# EAGLE design Thermal Gradient Experiment Board (EAGLE 6.3)
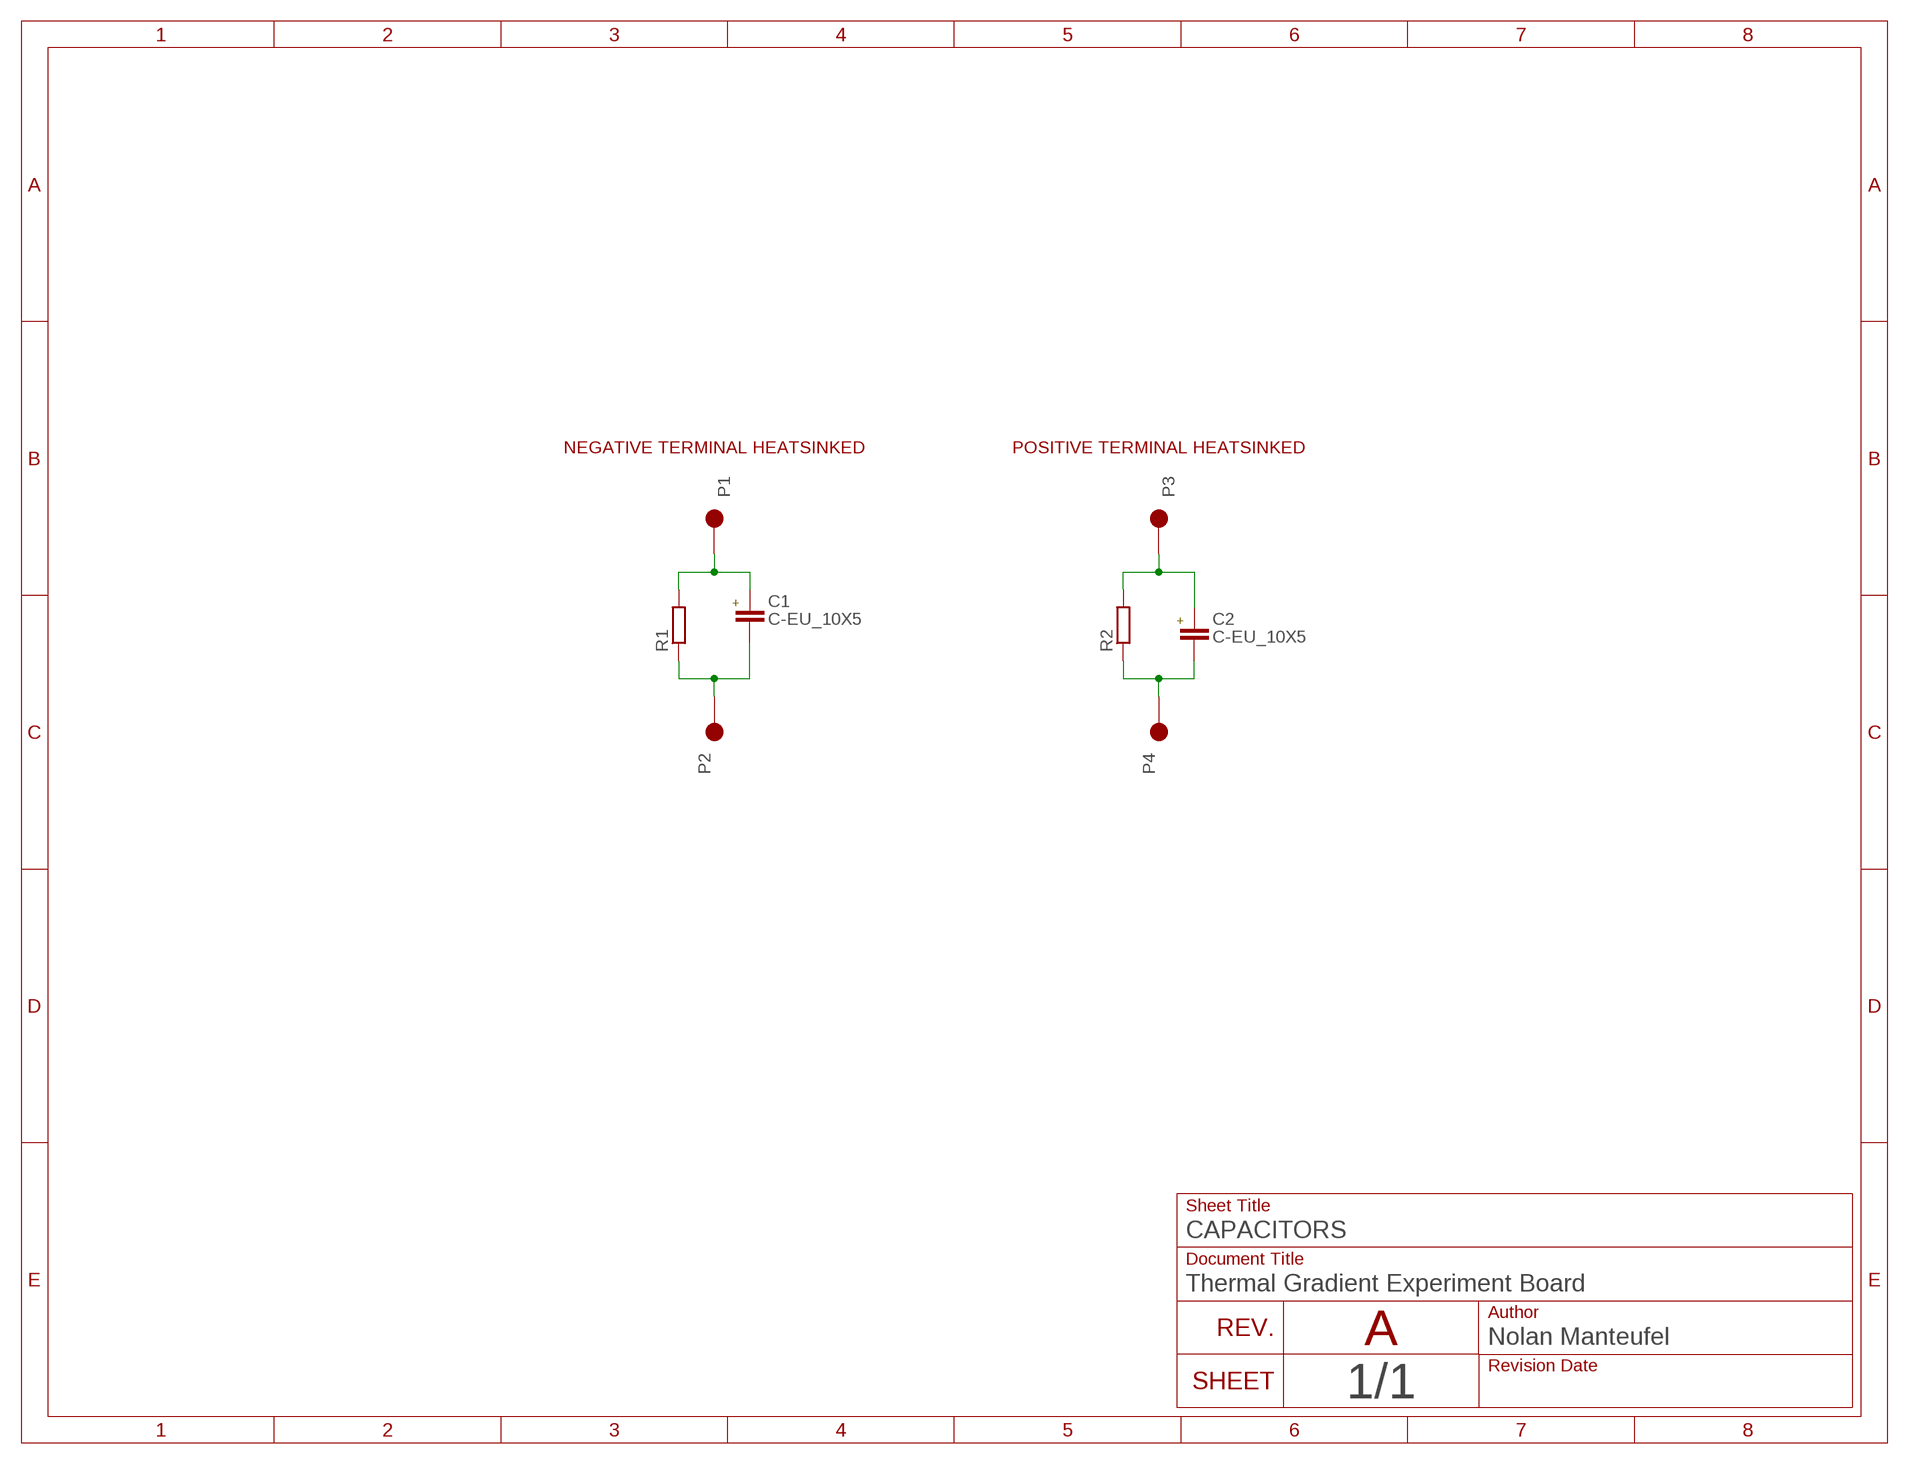
[diagram p0: schematic, sheet 1]

## Parts
C1  C-EU_10X5  [C_PZF_10]
C2  C-EU_10X5  [C_PZF_10]
P1  PINS_1_2MM2  [PINS_1_2MM2]
P2  PINS_1_2MM2  [PINS_1_2MM2]
P3  PINS_1_2MM2  [PINS_1_2MM2]
P4  PINS_1_2MM2  [PINS_1_2MM2]
R1  R-EU__VISHAY_THJP1225AST1  [R_THERMAL_1225]
R2  R-EU__VISHAY_THJP1225AST1  [R_THERMAL_1225]

## Nets
N$1: C1.1+ P1.1 R1.2
N$2: C1.2- P2.1 R1.1
N$3: C2.1+ P3.1 R2.2
N$4: C2.2- P4.1 R2.1

## Notes on the sheet
- NEGATIVE TERMINAL HEATSINKED | POSITIVE TERMINAL HEATSINKED
- A

## Library data of the parts
C1 C2 = nolan:C-EU: CAPACITOR, European symbol
P1-P4 = nolan:PINS_1
R1 R2 = nolan:R-EU_: RESISTOR, European symbol

## Board
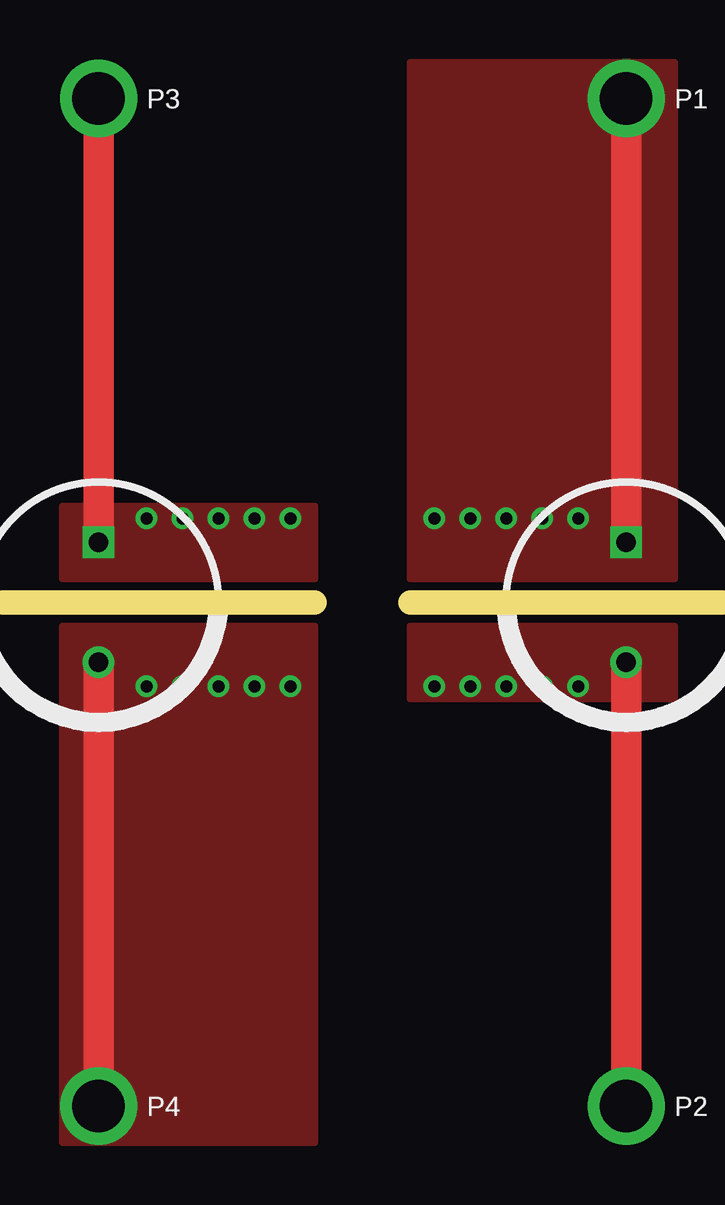
[diagram p1: board, top side]
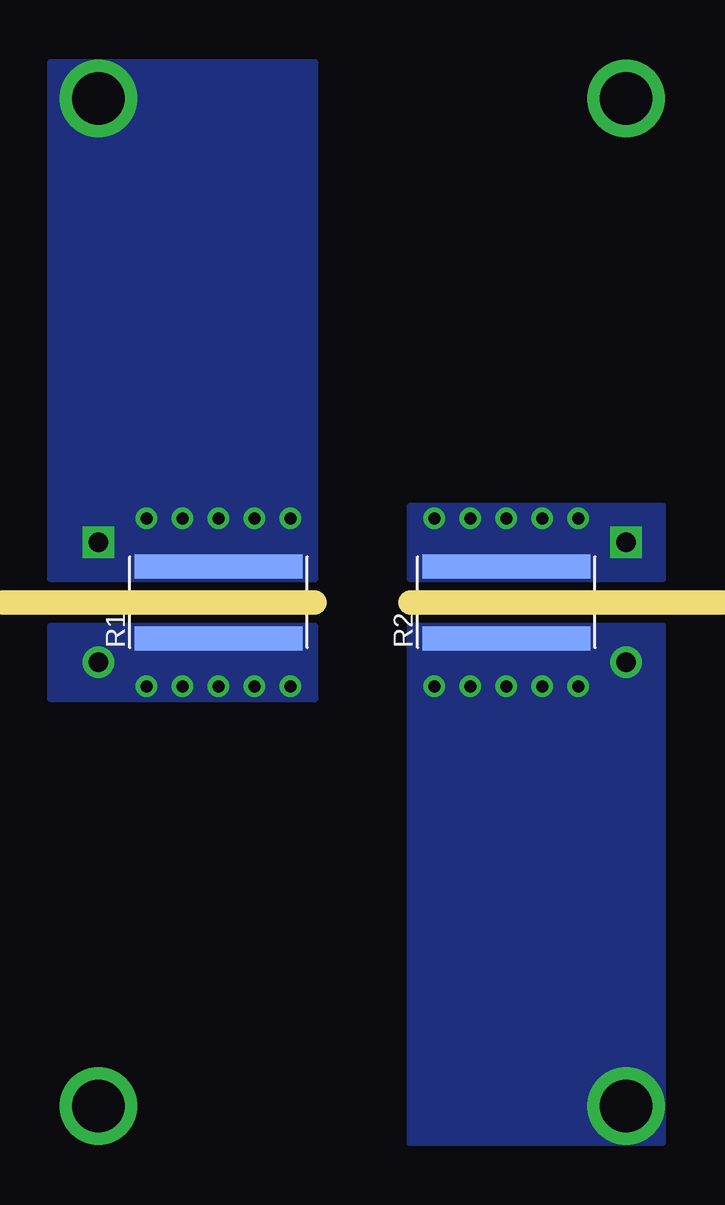
[diagram p2: board, bottom side, seen from below]

No outline drawn. Coordinates in mm, seen from the top.
Copper layers (1*16): Top 0.035mm / dielectric 1.5mm / Bottom 0.035mm
Design rules "default *": minimum track width 10mil, minimum drill 24mil, track to track 8mil, track to pad 8mil, pad to pad 8mil, via to via 8mil, smd to smd 8mil, copper to edge 40mil, drill to drill 8mil, minimum pad ring 10mil, minimum via ring 8mil, stop-mask expansion 4mil, vias tented up to drill 20mil, thermal gap 10mil
Holes 3.2 mm at 4,46 46,4 4,4 46,46
Milling: 2 lines

### Footprints (pad centres in the part's own frame; a part is rotated, then mirrored left to right if it is on the bottom)
C_PZF_10 = drill 0.8 square: 1+ 2.5,0 | drill 0.8: 2- -2.5,0
PINS_1_2MM2 = drill 2.2: 1 0,0
R_THERMAL_1225 = smd 1 x 7: 1 -1.5,0; 2 1.5,0

### Placement (x,y rotation side)
C1  36,25 90 top
C2  14,25 90 top
P1  36,46 0 top
P2  36,4 0 top
P3  14,46 0 top
P4  14,4 0 top
R1  31,25 90 bottom
R2  19,25 90 bottom

### Tracks (layer width: path | path; a pad name or v marks a point on that pad's centre or on a via)
N$1  (via drill 0.5)
  Top 1.27: P1.1 C1.1+
  other vias: 28,28.5 29.5,28.5 31,28.5 32.5,28.5 34,28.5
  pour Bottom (no thermals): 27,26 38,26 38,47.5 27,47.5
  pour Top (no thermals): 27,26 38,26 38,47.5 27,47.5
N$2  (via drill 0.5)
  Top 1.27: C1.2- P2.1
  other vias: 28,21.5 29.5,21.5 31,21.5 32.5,21.5 34,21.5
  pour Bottom (no thermals): 27,24 38,24 38,21 27,21
  pour Top (no thermals): 27,24 38,24 38,21 27,21
N$3  (via drill 0.5)
  Top 1.27: P3.1 C2.1+
  other vias: 16,28.5 17.5,28.5 19,28.5 20.5,28.5 22,28.5
  pour Bottom (no thermals): 12.5,26 23,26 23,29 12.5,29
  pour Top (no thermals): 12.5,26 23,26 23,29 12.5,29
N$4  (via drill 0.5)
  Top 1.27: C2.2- P4.1
  other vias: 16,21.5 17.5,21.5 19,21.5 20.5,21.5 22,21.5
  pour Top (no thermals): 12.5,24 23,24 23,2.5 12.5,2.5
  pour Bottom (no thermals): 12.5,24 23,24 23,2.5 12.5,2.5

### Text on the board
tPlace: CAPACITORS: 10mm diameter, 5mm pitch | THERMAWICK: THJP1225AST1 | THERMAL GRADIENT EXPERIMENT BOARD | NM.03MAR2021
_tPlace: P3 | P1 | P4 | P2
_tNames: C2 | C1
_bNames: R2 | R1